# EAGLE design Board (EAGLE 6.5.0)
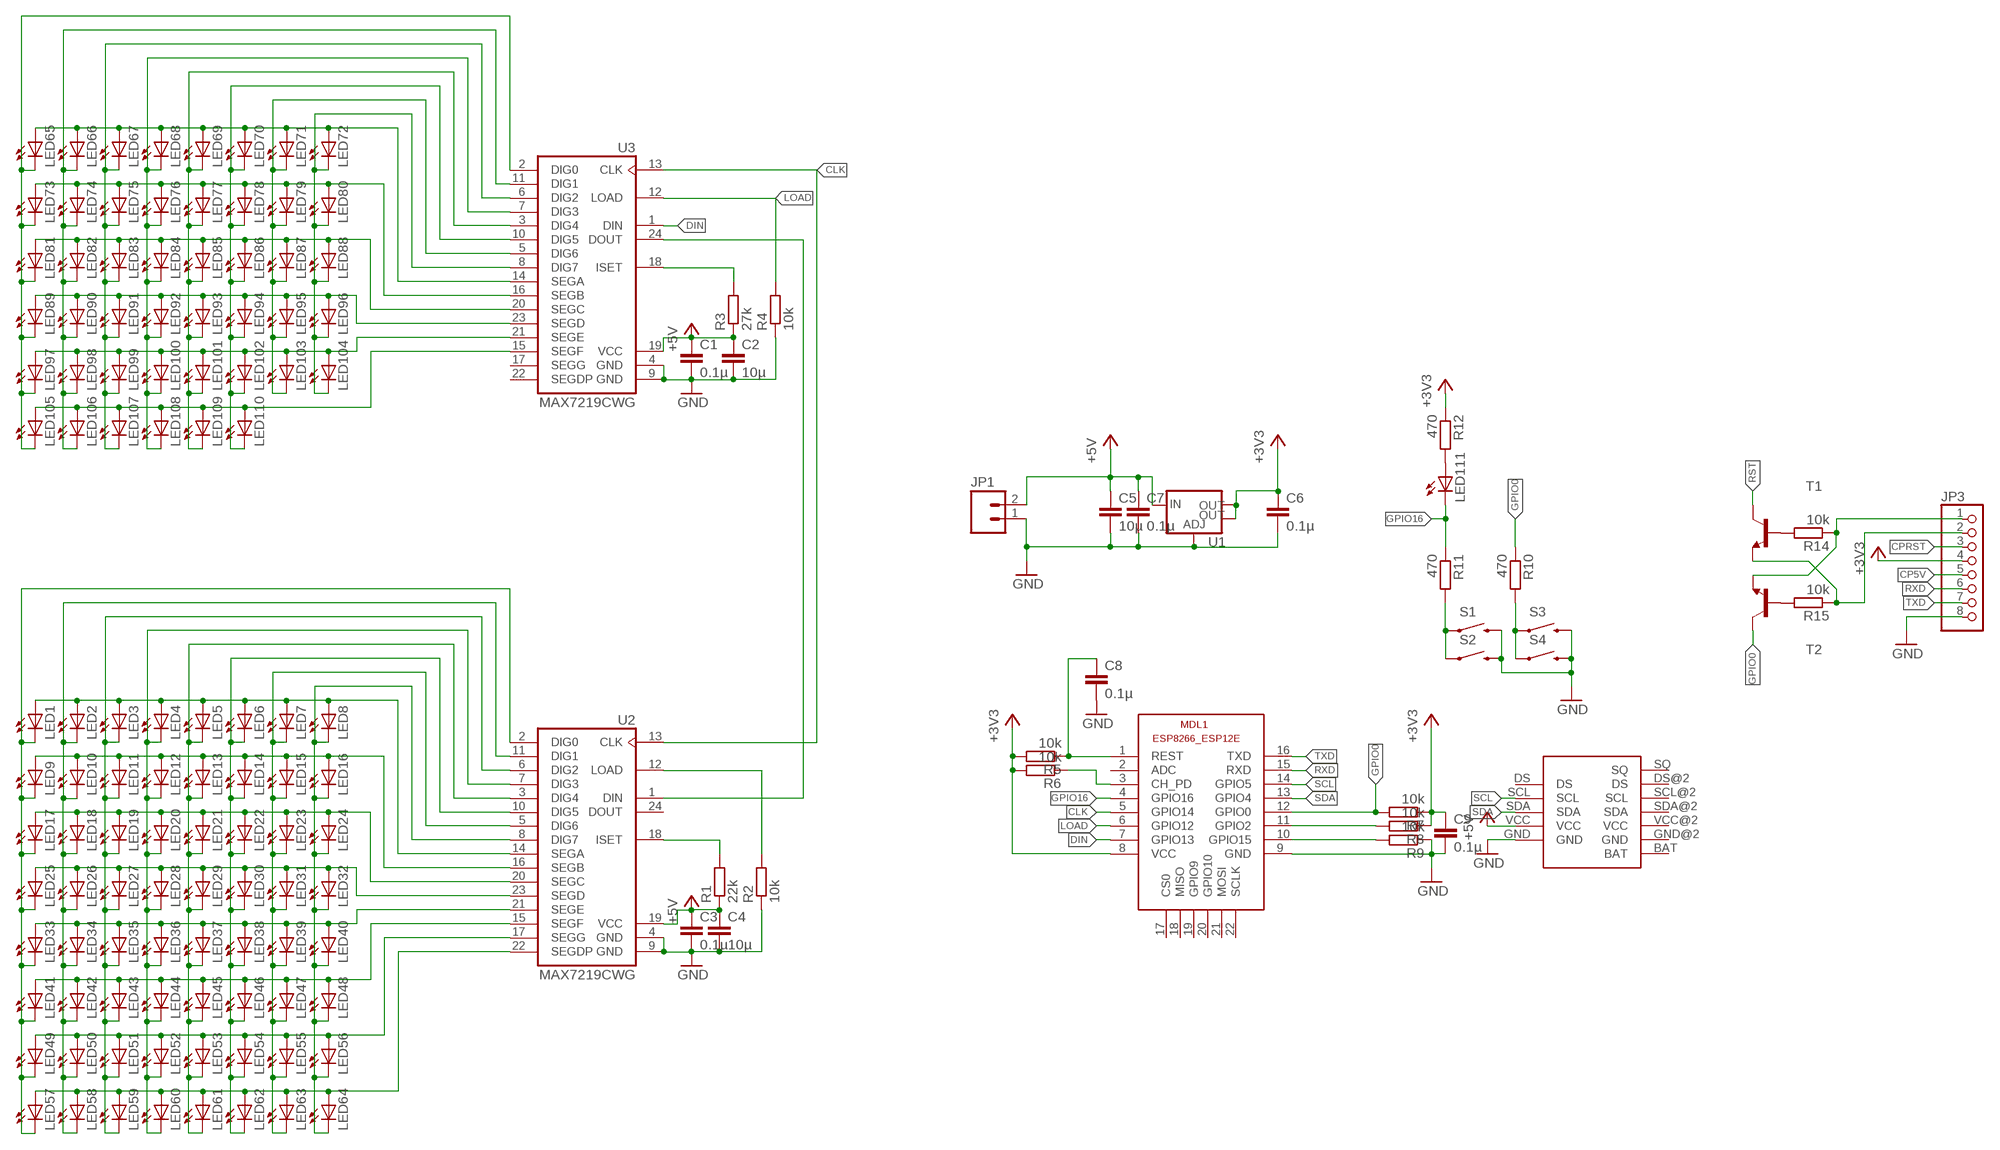
[diagram p0: schematic, sheet 1]

## Parts
C1  0.1µ  C-EUC0603  [C0603]
C2  10µ  C-EUC0603  [C0603]
C3  0.1µ  C-EUC0603  [C0603]
C4  10µ  C-EUC0603  [C0603]
C5  10µ  C-EUC0603  [C0603]
C6  0.1µ  C-EUC0603  [C0603]
C7  0.1µ  C-EUC0603  [C0603]
C8  0.1µ  C-EUC0603  [C0603]
C9  0.1µ  C-EUC0603  [C0603]
JP1  M02POLAR  [MOLEX-1X2]
JP3  PINHD-1X8  [1X08]
LED1  LEDCHIPLED_0805  [CHIPLED_0805]
LED2  LEDCHIPLED_0805  [CHIPLED_0805]
LED3  LEDCHIPLED_0805  [CHIPLED_0805]
LED4  LEDCHIPLED_0805  [CHIPLED_0805]
LED5  LEDCHIPLED_0805  [CHIPLED_0805]
LED6  LEDCHIPLED_0805  [CHIPLED_0805]
LED7  LEDCHIPLED_0805  [CHIPLED_0805]
LED8  LEDCHIPLED_0805  [CHIPLED_0805]
LED9  LEDCHIPLED_0805  [CHIPLED_0805]
LED10  LEDCHIPLED_0805  [CHIPLED_0805]
LED11  LEDCHIPLED_0805  [CHIPLED_0805]
LED12  LEDCHIPLED_0805  [CHIPLED_0805]
LED13  LEDCHIPLED_0805  [CHIPLED_0805]
LED14  LEDCHIPLED_0805  [CHIPLED_0805]
LED15  LEDCHIPLED_0805  [CHIPLED_0805]
LED16  LEDCHIPLED_0805  [CHIPLED_0805]
LED17  LEDCHIPLED_0805  [CHIPLED_0805]
LED18  LEDCHIPLED_0805  [CHIPLED_0805]
LED19  LEDCHIPLED_0805  [CHIPLED_0805]
LED20  LEDCHIPLED_0805  [CHIPLED_0805]
LED21  LEDCHIPLED_0805  [CHIPLED_0805]
LED22  LEDCHIPLED_0805  [CHIPLED_0805]
LED23  LEDCHIPLED_0805  [CHIPLED_0805]
LED24  LEDCHIPLED_0805  [CHIPLED_0805]
LED25  LEDCHIPLED_0805  [CHIPLED_0805]
LED26  LEDCHIPLED_0805  [CHIPLED_0805]
LED27  LEDCHIPLED_0805  [CHIPLED_0805]
LED28  LEDCHIPLED_0805  [CHIPLED_0805]
LED29  LEDCHIPLED_0805  [CHIPLED_0805]
LED30  LEDCHIPLED_0805  [CHIPLED_0805]
LED31  LEDCHIPLED_0805  [CHIPLED_0805]
LED32  LEDCHIPLED_0805  [CHIPLED_0805]
LED33  LEDCHIPLED_0805  [CHIPLED_0805]
LED34  LEDCHIPLED_0805  [CHIPLED_0805]
LED35  LEDCHIPLED_0805  [CHIPLED_0805]
LED36  LEDCHIPLED_0805  [CHIPLED_0805]
LED37  LEDCHIPLED_0805  [CHIPLED_0805]
LED38  LEDCHIPLED_0805  [CHIPLED_0805]
LED39  LEDCHIPLED_0805  [CHIPLED_0805]
LED40  LEDCHIPLED_0805  [CHIPLED_0805]
LED41  LEDCHIPLED_0805  [CHIPLED_0805]
LED42  LEDCHIPLED_0805  [CHIPLED_0805]
LED43  LEDCHIPLED_0805  [CHIPLED_0805]
LED44  LEDCHIPLED_0805  [CHIPLED_0805]
LED45  LEDCHIPLED_0805  [CHIPLED_0805]
LED46  LEDCHIPLED_0805  [CHIPLED_0805]
LED47  LEDCHIPLED_0805  [CHIPLED_0805]
LED48  LEDCHIPLED_0805  [CHIPLED_0805]
LED49  LEDCHIPLED_0805  [CHIPLED_0805]
LED50  LEDCHIPLED_0805  [CHIPLED_0805]
LED51  LEDCHIPLED_0805  [CHIPLED_0805]
LED52  LEDCHIPLED_0805  [CHIPLED_0805]
LED53  LEDCHIPLED_0805  [CHIPLED_0805]
LED54  LEDCHIPLED_0805  [CHIPLED_0805]
LED55  LEDCHIPLED_0805  [CHIPLED_0805]
LED56  LEDCHIPLED_0805  [CHIPLED_0805]
LED57  LEDCHIPLED_0805  [CHIPLED_0805]
LED58  LEDCHIPLED_0805  [CHIPLED_0805]
LED59  LEDCHIPLED_0805  [CHIPLED_0805]
LED60  LEDCHIPLED_0805  [CHIPLED_0805]
LED61  LEDCHIPLED_0805  [CHIPLED_0805]
LED62  LEDCHIPLED_0805  [CHIPLED_0805]
LED63  LEDCHIPLED_0805  [CHIPLED_0805]
LED64  LEDCHIPLED_0805  [CHIPLED_0805]
LED65  LEDCHIPLED_0805  [CHIPLED_0805]
LED66  LEDCHIPLED_0805  [CHIPLED_0805]
LED67  LEDCHIPLED_0805  [CHIPLED_0805]
LED68  LEDCHIPLED_0805  [CHIPLED_0805]
LED69  LEDCHIPLED_0805  [CHIPLED_0805]
LED70  LEDCHIPLED_0805  [CHIPLED_0805]
LED71  LEDCHIPLED_0805  [CHIPLED_0805]
LED72  LEDCHIPLED_0805  [CHIPLED_0805]
LED73  LEDCHIPLED_0805  [CHIPLED_0805]
LED74  LEDCHIPLED_0805  [CHIPLED_0805]
LED75  LEDCHIPLED_0805  [CHIPLED_0805]
LED76  LEDCHIPLED_0805  [CHIPLED_0805]
LED77  LEDCHIPLED_0805  [CHIPLED_0805]
LED78  LEDCHIPLED_0805  [CHIPLED_0805]
LED79  LEDCHIPLED_0805  [CHIPLED_0805]
LED80  LEDCHIPLED_0805  [CHIPLED_0805]
LED81  LEDCHIPLED_0805  [CHIPLED_0805]
LED82  LEDCHIPLED_0805  [CHIPLED_0805]
LED83  LEDCHIPLED_0805  [CHIPLED_0805]
LED84  LEDCHIPLED_0805  [CHIPLED_0805]
LED85  LEDCHIPLED_0805  [CHIPLED_0805]
LED86  LEDCHIPLED_0805  [CHIPLED_0805]
LED87  LEDCHIPLED_0805  [CHIPLED_0805]
LED88  LEDCHIPLED_0805  [CHIPLED_0805]
LED89  LEDCHIPLED_0805  [CHIPLED_0805]
LED90  LEDCHIPLED_0805  [CHIPLED_0805]
LED91  LEDCHIPLED_0805  [CHIPLED_0805]
LED92  LEDCHIPLED_0805  [CHIPLED_0805]
LED93  LEDCHIPLED_0805  [CHIPLED_0805]
LED94  LEDCHIPLED_0805  [CHIPLED_0805]
LED95  LEDCHIPLED_0805  [CHIPLED_0805]
LED96  LEDCHIPLED_0805  [CHIPLED_0805]
LED97  LEDCHIPLED_0805  [CHIPLED_0805]
LED98  LEDCHIPLED_0805  [CHIPLED_0805]
LED99  LEDCHIPLED_0805  [CHIPLED_0805]
LED100  LEDCHIPLED_0805  [CHIPLED_0805]
LED101  LEDCHIPLED_0805  [CHIPLED_0805]
LED102  LEDCHIPLED_0805  [CHIPLED_0805]
LED103  LEDCHIPLED_0805  [CHIPLED_0805]
LED104  LEDCHIPLED_0805  [CHIPLED_0805]
LED105  LEDCHIPLED_0805  [CHIPLED_0805]
LED106  LEDCHIPLED_0805  [CHIPLED_0805]
LED107  LEDCHIPLED_0805  [CHIPLED_0805]
LED108  LEDCHIPLED_0805  [CHIPLED_0805]
LED109  LEDCHIPLED_0805  [CHIPLED_0805]
LED110  LEDCHIPLED_0805  [CHIPLED_0805]
LED111  LEDCHIPLED_0805  [CHIPLED_0805]
MDL1  ESP8266-12EESP8266-ESP12E  [ESP8266-ESP12E]
R1  22k  R-EU_R0603  [R0603]
R2  10k  R-EU_R0603  [R0603]
R3  27k  R-EU_R0603  [R0603]
R4  10k  R-EU_R0603  [R0603]
R5  10k  R-EU_R0603  [R0603]
R6  10k  R-EU_R0603  [R0603]
R7  10k  R-EU_R0603  [R0603]
R8  10k  R-EU_R0603  [R0603]
R9  10k  R-EU_R0603  [R0603]
R10  470  R-EU_R0603  [R0603]
R11  470  R-EU_R0603  [R0603]
R12  470  R-EU_R0603  [R0603]
R14  10k  R-EU_R0603  [R0603]
R15  10k  R-EU_R0603  [R0603]
S1  SWITCH-MOMENTARY-2SIDE_EZ  [TACTILE-PTH-SIDEEZ]
S2  SWITCH-MOMENTARY-2SMD-1101NE  [TACTILE-SWITCH-1101NE]
S3  SWITCH-MOMENTARY-2SIDE_EZ  [TACTILE-PTH-SIDEEZ]
S4  SWITCH-MOMENTARY-2SMD-1101NE  [TACTILE-SWITCH-1101NE]
T1  BC847-NPN-SOT23-BEC  [SOT23-BEC]
T2  BC847-NPN-SOT23-BEC  [SOT23-BEC]
U1  V_REG_LM1117SOT223  [SOT223]
U2  MAX7219CWG  [SO24L]
U3  MAX7219CWG  [SO24L]
U$3  DS1307-MODULE  [DS1307-MODULE]

## Nets
+3V3: C6.1 C9.1 JP3.4 MDL1.8(VCC) R5.2 R6.2 R7.1 R8.1 R12.1 U1.2(OUT) U1.4(OUT)
+5V: C1.1 C2.1 C3.1 C4.1 C5.1 C7.1 JP1.2 R1.1 R3.1 U1.3(IN) U2.19(VCC) U3.19(VCC) U$3.VCC
CLK: MDL1.5(GPIO14) U2.13(CLK) U3.13(CLK)
CP5V: JP3.5
CPRST: JP3.3
DIN: MDL1.7(GPIO13) U3.1(DIN)
DTR: JP3.1 R14.1 T2.E
GND: C1.2 C2.2 C3.2 C4.2 C5.2 C6.2 C7.2 C8.2 C9.2 JP1.1 JP3.8 MDL1.9(GND) R2.1 R4.1 R9.1 S1.2 S2.2 S3.2 S4.2 U1.1(ADJ) U2.4(GND) U2.9(GND) U3.4(GND) U3.9(GND) U$3.GND
GPIO0: MDL1.12(GPIO0) R7.2 R10.1 T2.C
GPIO16: LED111.C MDL1.4(GPIO16) R11.1
LOAD: MDL1.6(GPIO12) R4.2 U3.12(LOAD)
N$1: LED1.C LED9.C LED17.C LED25.C LED33.C LED41.C LED49.C LED57.C U2.2(DIG0)
N$2: LED2.C LED10.C LED18.C LED26.C LED34.C LED42.C LED50.C LED58.C U2.11(DIG1)
N$3: LED9.A LED10.A LED11.A LED12.A LED13.A LED14.A LED15.A LED16.A U2.16(SEGB)
N$4: LED17.A LED18.A LED19.A LED20.A LED21.A LED22.A LED23.A LED24.A U2.20(SEGC)
N$5: LED3.C LED11.C LED19.C LED27.C LED35.C LED43.C LED51.C LED59.C U2.6(DIG2)
N$6: LED4.C LED12.C LED20.C LED28.C LED36.C LED44.C LED52.C LED60.C U2.7(DIG3)
N$7: LED5.C LED13.C LED21.C LED29.C LED37.C LED45.C LED53.C LED61.C U2.3(DIG4)
N$8: LED6.C LED14.C LED22.C LED30.C LED38.C LED46.C LED54.C LED62.C U2.10(DIG5)
N$9: LED7.C LED15.C LED23.C LED31.C LED39.C LED47.C LED55.C LED63.C U2.5(DIG6)
N$10: LED8.C LED16.C LED24.C LED32.C LED40.C LED48.C LED56.C LED64.C U2.8(DIG7)
N$11: LED1.A LED2.A LED3.A LED4.A LED5.A LED6.A LED7.A LED8.A U2.14(SEGA)
N$12: LED25.A LED26.A LED27.A LED28.A LED29.A LED30.A LED31.A LED32.A U2.23(SEGD)
N$13: LED33.A LED34.A LED35.A LED36.A LED37.A LED38.A LED39.A LED40.A U2.21(SEGE)
N$14: LED41.A LED42.A LED43.A LED44.A LED45.A LED46.A LED47.A LED48.A U2.15(SEGF)
N$15: LED49.A LED50.A LED51.A LED52.A LED53.A LED54.A LED55.A LED56.A U2.17(SEGG)
N$16: LED57.A LED58.A LED59.A LED60.A LED61.A LED62.A LED63.A LED64.A U2.22(SEGDP)
N$17: LED66.C LED74.C LED82.C LED90.C LED98.C LED106.C U3.11(DIG1)
N$18: LED65.C LED73.C LED81.C LED89.C LED97.C LED105.C U3.2(DIG0)
N$19: LED67.C LED75.C LED83.C LED91.C LED99.C LED107.C U3.6(DIG2)
N$20: LED68.C LED76.C LED84.C LED92.C LED100.C LED108.C U3.7(DIG3)
N$21: LED69.C LED77.C LED85.C LED93.C LED101.C LED109.C U3.3(DIG4)
N$22: LED70.C LED78.C LED86.C LED94.C LED102.C LED110.C U3.10(DIG5)
N$23: LED71.C LED79.C LED87.C LED95.C LED103.C U3.5(DIG6)
N$24: LED72.C LED80.C LED88.C LED96.C LED104.C U3.8(DIG7)
N$25: LED65.A LED66.A LED67.A LED68.A LED69.A LED70.A LED71.A LED72.A U3.14(SEGA)
N$26: LED73.A LED74.A LED75.A LED76.A LED77.A LED78.A LED79.A LED80.A U3.16(SEGB)
N$27: LED81.A LED82.A LED83.A LED84.A LED85.A LED86.A LED87.A LED88.A U3.20(SEGC)
N$28: LED89.A LED90.A LED91.A LED92.A LED93.A LED94.A LED95.A LED96.A U3.23(SEGD)
N$29: LED97.A LED98.A LED99.A LED100.A LED101.A LED102.A LED103.A LED104.A U3.21(SEGE)
N$30: LED105.A LED106.A LED107.A LED108.A LED109.A LED110.A U3.15(SEGF)
N$32: R10.2 S3.1 S4.1
N$33: R2.2 U2.12(LOAD)
N$34: R14.2 T1.B
N$35: U2.1(DIN) U3.24(DOUT)
N$36: MDL1.3(CH_PD) R6.1
N$38: R15.2 T2.B
N$39: LED111.A R12.2
N$40: MDL1.11(GPIO2) R8.2
N$41: R3.2 U3.18(ISET)
N$42: MDL1.10(GPIO15) R9.2
N$43: R1.2 U2.18(ISET)
N$45: R11.2 S1.1 S2.1
RST: C8.1 MDL1.1(REST) R5.1 T1.C
RTS: JP3.2 R15.1 T1.E
RXD: JP3.6 MDL1.15(RXD)
SCL: MDL1.14(GPIO5) U$3.SCL
SDA: MDL1.13(GPIO4) U$3.SDA
TXD: JP3.7 MDL1.16(TXD)
Unconnected: MDL1.2(ADC) MDL1.17(CS0) MDL1.18(MISO) MDL1.19(GPIO9) MDL1.20(GPIO10) MDL1.21(MOSI) MDL1.22(SCLK) U2.24(DOUT) U3.17(SEGG) U3.22(SEGDP) U$3.BAT U$3.DS U$3.DS@2(DS) U$3.GND@2(GND) U$3.SCL@2(SCL) U$3.SDA@2(SDA) U$3.SQ U$3.VCC@2(VCC)

## Library data of the parts
C1-C9 = rcl:C-EU: CAPACITOR, European symbol
JP1 = SparkFun-Connectors:M02: Standard 2-pin 0.1" header. Use with - straight break away headers ( PRT-00116) - right angle break away headers (PRT-00553) - swiss pins (PRT-00743) - machine pins (PRT-00117) - female headers (PRT-00115) Molex polarized connector foot print use with: PRT-08233 with associated crimp pins and housings. 2.54_SCREWTERM for use with PRT-10571. 3.5mm Screw Terminal footprints for PRT-08084 5mm Screw Terminal footprints for use with PRT-08432
JP3 = pinhead:PINHD-1X8: PIN HEADER
LED1-LED111 = led:LED: LED OSRAM: - CHIPLED LG R971, LG N971, LY N971, LG Q971, LY Q971, LO R971, LY R971 LH N974, LH R974 LS Q976, LO Q976, LY Q976 LO Q996 - Hyper CHIPLED LW Q18S LB Q993, LB Q99A, LB R99A - SideLED LS A670, LO A670, LY A670, LG A670, LP A670 LB A673, LV A673, LT A673, LW A673 LH A674 LY A675 LS A676, LA A676, LO A676, LY A676, LW A676 LS A679, LY A679, LG A679 - Hyper Micro SIDELED® LS Y876, LA Y876, LO Y876, LY Y876 LT Y87S - SmartLED LW L88C, LW L88S LB L89C, LB L89S, LG L890 LS L89K, LO L89K, LY L89K LS L896, LA L896, LO L896, LY L896 - TOPLED LS T670, LO T670, LY T670, LG T670, LP T670 LSG T670, LSP T670, LSY T670, LOP T670, LYG T670 LG T671, LOG T671, LSG T671 LB T673, LV T673, LT T673, LW T673 LH T674 LS T676, LA T676, LO T676, LY T676, LB T676, LH T676, LSB T676, LW T676 LB T67C, LV T67C, LT T67C, LS T67K, LO T67K, LY T67K, LW E67C LS E67B, LA E67B, LO E67B, LY E67B, LB E67C, LV E67C, LT E67C LW T67C LS T679, LY T679, LG T679 LS T770, LO T770, LY T770, LG T770, LP T770 LB T773, LV T773, LT T773, LW T773 LH T774 LS E675, LA E675, LY E675, LS T675 LS T776, LA T776, LO T776, LY T776, LB T776 LHGB T686 LT T68C, LB T68C - Hyper Mini TOPLED® LB M676 - Mini TOPLED Santana® LG M470 LS M47K, LO M47K, LY M47K Source: http://www.osram.convergy.de LUXEON: - LUMILED® LXK2-PW12-R00, LXK2-PW12-S00, LXK2-PW14-U00, LXK2-PW14-V00 LXK2-PM12-R00, LXK2-PM12-S00, LXK2-PM14-U00 LXK2-PE12-Q00, LXK2-PE12-R00, LXK2-PE12-S00, LXK2-PE14-T00, LXK2-PE14-U00 LXK2-PB12-K00, LXK2-PB12-L00, LXK2-PB12-M00, LXK2-PB14-N00, LXK2-PB14-P00, LXK2-PB14-Q00 LXK2-PR12-L00, LXK2-PR12-M00, LXK2-PR14-Q00, LXK2-PR14-R00 LXK2-PD12-Q00, LXK2-PD12-R00, LXK2-PD12-S00 LXK2-PH12-R00, LXK2-PH12-S00 LXK2-PL12-P00, LXK2-PL12-Q00, LXK2-PL12-R00 Source: www.luxeon.com KINGBRIGHT: KA-3528ASYC Source: www.kingbright.com
MDL1 = ESP8266-ESP12E:ESP8266-12E: ESP8266-12E with additional I/O and GPIO04/05 corrected The author cannot warrant that this library is free from error or will meet your specific requirements. Created by PuceBaboon.com. Komagane, Nagano, JAPAN
R1-R12 R14 R15 = rcl:R-EU_: RESISTOR, European symbol
S1 S3 = SparkFun-Electromechanical:SWITCH-MOMENTARY-2: Various NO switches- pushbuttons, reed, etc
S2 S4 = SparkFun-Electromechanical:SWITCH-MOMENTARY-2: Various NO switches- pushbuttons, reed, etc; PROD_ID: SWCH-00815
T1 T2 = transistor:*-NPN-: NPN Transistror BF959 corrected 2008.03.06
U1 = SparkFun-PowerIC:V_REG_LM1117: Voltage Regulator LM1117 Standard adjustable voltage regulator but in SMD form. Spark Fun Electronics SKU : COM-00595; PROD_ID: VREG-08170
U2 U3 = max7219:MAX7219CWG
U$3 = OwnStuff:DS1307-MODULE

## Board
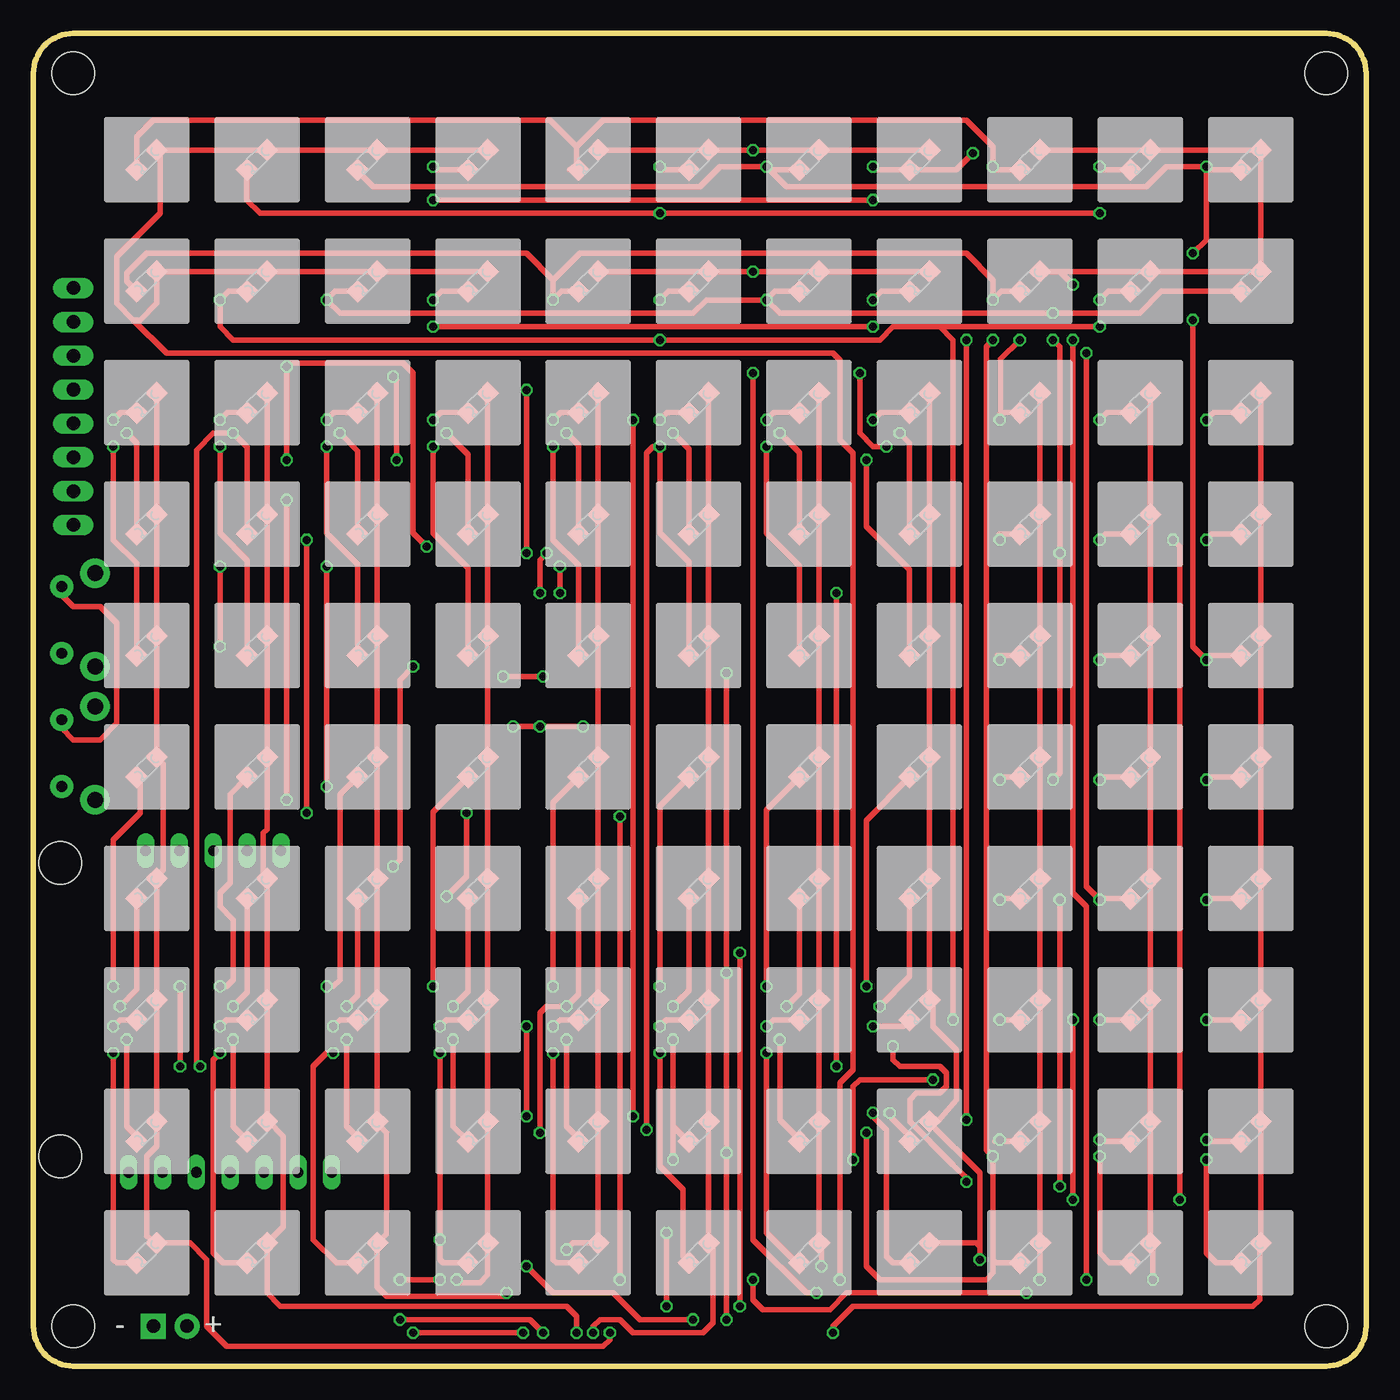
[diagram p1: board, top side]
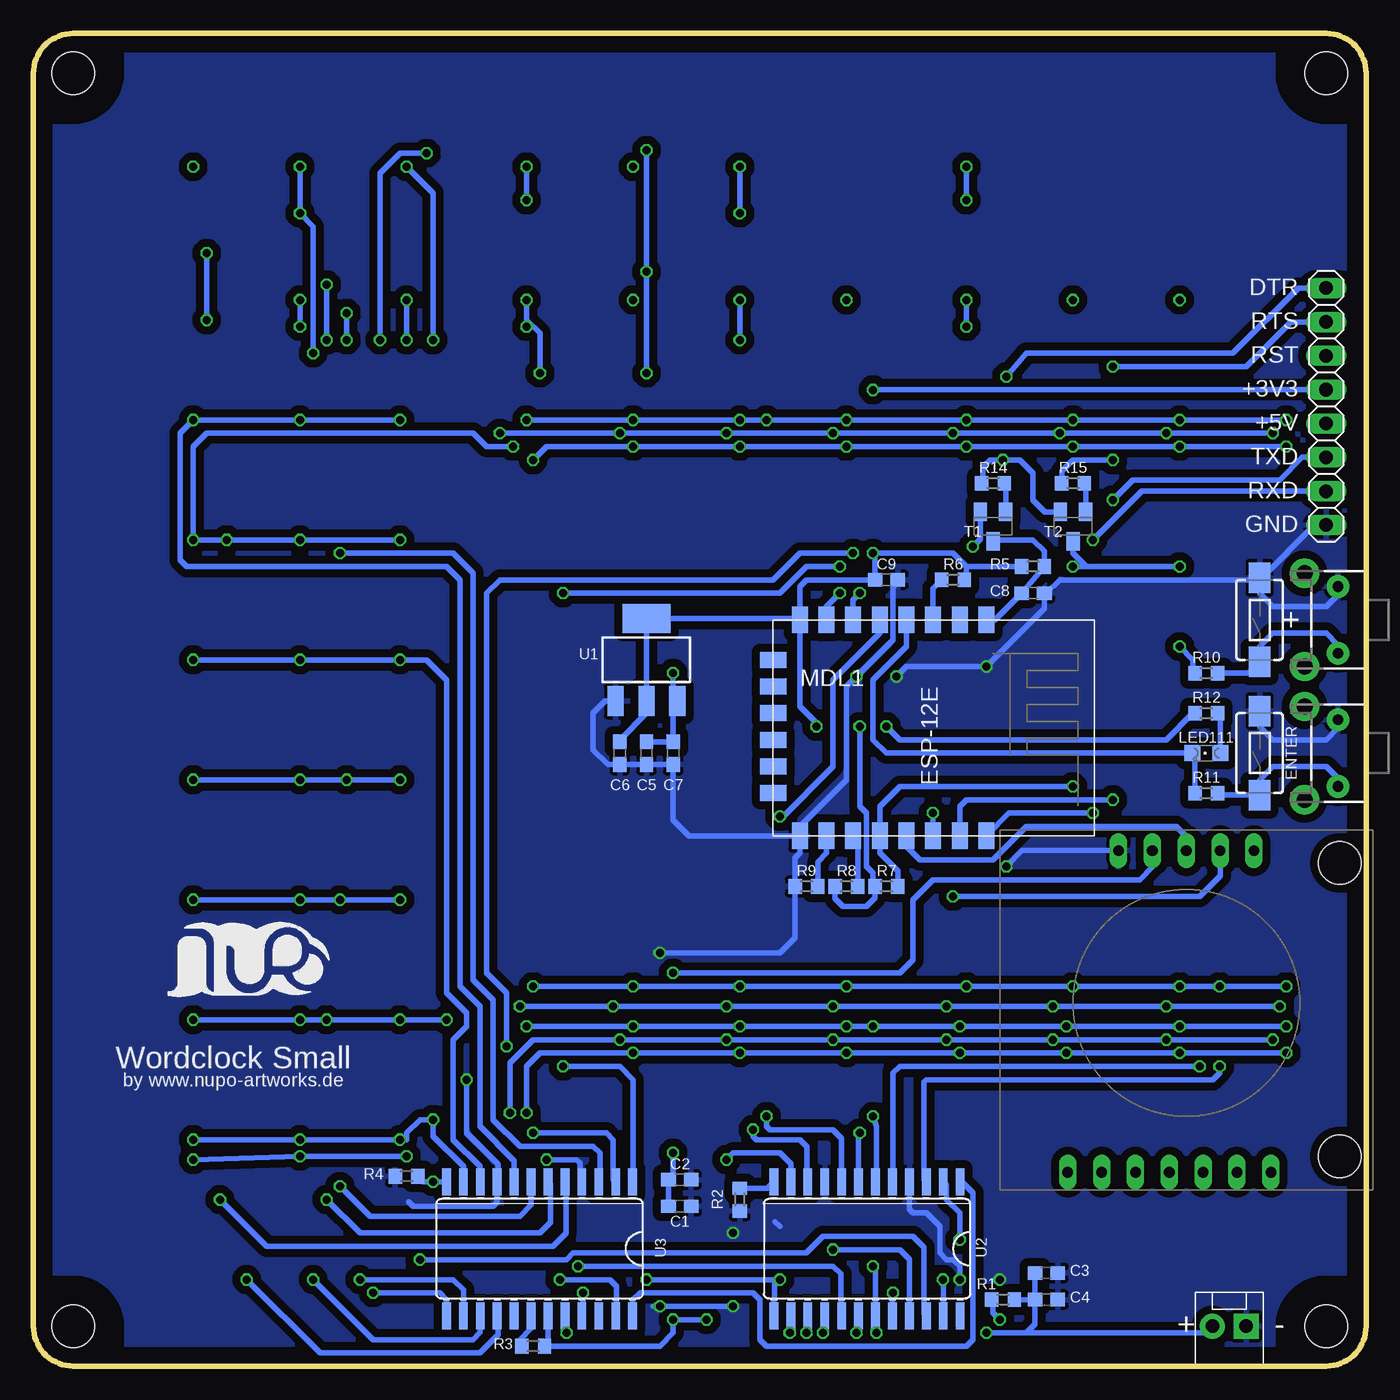
[diagram p2: board, bottom side, seen from below]

Size 100 x 100 mm. Coordinates in mm from the lower left corner, seen from the top.
Outline: 3,0 arc-90 0,3 0,97 arc-90 3,100 97,100 arc-90 100,97 100,3 arc-90 97,0 3,0
Copper layers (1*16): Top 0.035mm / dielectric 1.5mm / Bottom 0.035mm
Design rules "dirt_cheap_dirty_boards.v1": minimum track width 5mil, minimum drill 12mil, track to track 5mil, track to pad 5mil, pad to pad 5mil, via to via 5mil, smd to smd 0mil, copper to edge 10mil, drill to drill 10mil, minimum pad ring 10mil, minimum via ring 6mil, stop-mask expansion 2mil, vias tented up to drill 25mil, thermal gap 10mil
Holes 3.2 mm at 3,97 97,97 3,3 97,3
tKeepout: area 21,40 to 27,56; 4 lines
bKeepout: area 21,40 to 27,56; 4 lines
tRestrict: area 0,0 to 6,6; area 94,94 to 100,100; area 94,0 to 100,6; area 0,94 to 6,100; 4 lines
bRestrict: area 0,0 to 6,6; area 0,94 to 6,100; area 94,94 to 100,100; area 94,0 to 100,6; 4 lines

### Footprints (pad centres in the part's own frame; a part is rotated, then mirrored left to right if it is on the bottom)
C0603 = smd 1.1 x 1: 1 -0.85,0; 2 0.85,0
MOLEX-1X2 = drill 1.016 pad 1.88 square: 1 0,0 | drill 1.016 pad 1.88: 2 2.54,0
1X08 = drill 1.016 long: 1 -8.89,0; 2 -6.35,0; 3 -3.81,0; 4 -1.27,0; 5 1.27,0; 6 3.81,0; 7 6.35,0; 8 8.89,0
CHIPLED_0805 = smd 1.2 x 1.2: A 0,-1.05; C 0,1.05
ESP8266-ESP12E = smd 2 x 1.2: 1 0,16; 2 0,14; 3 0,12; 4 0,10; 5 0,8; 6 0,6; 7 0,4; 8 0,2; 9 16.2,2; 10 16.2,4; 11 16.2,6; 12 16.2,8; 13 16.2,10; 14 16.2,12; 15 16.2,14; 16 16.2,16 | smd 1.2 x 2: 17 11,0; 18 3,0; 19 5,0; 20 13,0; 21 7,0; 22 9,0
R0603 = smd 1 x 1.1: 1 -0.85,0; 2 0.85,0
TACTILE-PTH-SIDEEZ = drill 0.8 pad 1.7: 1 -2.5,0; 2 2.5,0 | drill 1.2 pad 2.2: ANCHOR1 -3.5,2.5; ANCHOR2 3.5,2.5
TACTILE-SWITCH-1101NE = smd 2.3 x 1.6: 1 -3.15,0; 2 3.15,0
SOT23-BEC = smd 1 x 1.4: B -0.95,-1.1; C 0,1.1; E 0.95,-1.1
SOT223 = smd 1.219 x 2.235: 1 -2.311,-3.099; 2 0,-3.099; 3 2.311,-3.099 | smd 3.6 x 2.2: 4 0,3.099
SO24L = smd 0.66 x 2.032: 1 -6.985,-5.029; 2 -5.715,-5.029; 3 -4.445,-5.029; 4 -3.175,-5.029; 5 -1.905,-5.029; 6 -0.635,-5.029; 7 0.635,-5.029; 8 1.905,-5.029; 9 3.175,-5.029; 10 4.445,-5.029; 11 5.715,-5.029; 12 6.985,-5.029; 13 6.985,5.029; 14 5.715,5.029; 15 4.445,5.029; 16 3.175,5.029; 17 1.905,5.029; 18 0.635,5.029; 19 -0.635,5.029; 20 -1.905,5.029; 21 -3.175,5.029; 22 -4.445,5.029; 23 -5.715,5.029; 24 -6.985,5.029
DS1307-MODULE = drill 0.8 long: BAT -8.89,-12.7; DS 5.08,11.43; DS@2 3.81,-12.7; GND -5.08,11.43; GND@2 -6.35,-12.7; SCL 2.54,11.43; SCL@2 1.27,-12.7; SDA 0,11.43; SDA@2 -1.27,-12.7; SQ 6.35,-12.7; VCC -2.54,11.43; VCC@2 -3.81,-12.7 | hole 3.2: 11.5,-11.5; 11.5,10.5

### Placement (x,y rotation side)
C1  51.5,14 0 bottom
C2  51.5,12 0 bottom
C3  24,7 0 bottom
C4  24,5 0 bottom
C5  54,46 270 bottom
C6  56,46 270 bottom
C7  52,46 270 bottom
C8  25,58 0 bottom
C9  36,59 0 bottom
JP1  9,3 180 bottom
JP3  3,72 270 bottom
LED1  8.5,8.5 135 top
LED2  8.5,17.61 135 top
LED3  8.5,26.72 135 top
LED4  8.5,35.83 135 top
LED5  8.5,44.95 135 top
LED6  8.5,54.06 135 top
LED7  8.5,63.17 135 top
LED8  8.5,72.28 135 top
LED9  16.78,8.5 135 top
LED10  16.78,17.61 135 top
LED11  16.78,26.72 135 top
LED12  16.78,35.83 135 top
LED13  16.78,44.95 135 top
LED14  16.78,54.06 135 top
LED15  16.78,63.17 135 top
LED16  16.78,72.28 135 top
LED17  25.07,8.5 135 top
LED18  25.07,17.61 135 top
LED19  25.07,26.72 135 top
LED20  25.07,35.83 135 top
LED21  25.07,44.95 135 top
LED22  25.07,54.06 135 top
LED23  25.07,63.17 135 top
LED24  25.07,72.28 135 top
LED25  33.35,8.5 135 top
LED26  33.35,17.61 135 top
LED27  33.35,26.72 135 top
LED28  33.35,35.83 135 top
LED29  33.35,44.95 135 top
LED30  33.35,54.06 135 top
LED31  33.35,63.17 135 top
LED32  33.35,72.28 135 top
LED33  41.64,8.5 135 top
LED34  41.64,17.61 135 top
LED35  41.64,26.72 135 top
LED36  41.64,35.83 135 top
LED37  41.64,44.95 135 top
LED38  41.64,54.06 135 top
LED39  41.64,63.17 135 top
LED40  41.64,72.28 135 top
LED41  49.92,8.5 135 top
LED42  49.92,17.61 135 top
LED43  49.92,26.72 135 top
LED44  49.92,35.83 135 top
LED45  49.92,44.95 135 top
LED46  49.92,54.06 135 top
LED47  49.92,63.17 135 top
LED48  49.92,72.28 135 top
LED49  58.21,8.5 135 top
LED50  58.21,17.61 135 top
LED51  58.21,26.72 135 top
LED52  58.21,35.83 135 top
LED53  58.21,44.95 135 top
LED54  58.21,54.06 135 top
LED55  58.21,63.17 135 top
LED56  58.21,72.28 135 top
LED57  66.49,8.5 135 top
LED58  66.49,17.61 135 top
LED59  66.49,26.72 135 top
LED60  66.49,35.83 135 top
LED61  66.49,44.95 135 top
LED62  66.49,54.06 135 top
LED63  66.49,63.17 135 top
LED64  66.49,72.28 135 top
LED65  74.77,8.5 135 top
LED66  74.77,17.61 135 top
LED67  74.77,26.72 135 top
LED68  74.77,35.83 135 top
LED69  74.77,44.95 135 top
LED70  74.77,54.06 135 top
LED71  74.77,63.17 135 top
LED72  74.77,72.28 135 top
LED73  83.06,8.5 135 top
LED74  83.06,17.61 135 top
LED75  83.06,26.72 135 top
LED76  83.06,35.83 135 top
LED77  83.06,44.95 135 top
LED78  83.06,54.06 135 top
LED79  83.06,63.17 135 top
LED80  83.06,72.28 135 top
LED81  91.34,8.5 135 top
LED82  91.34,17.61 135 top
LED83  91.34,26.72 135 top
LED84  91.34,35.83 135 top
LED85  91.34,44.95 135 top
LED86  91.34,54.06 135 top
LED87  91.34,63.17 135 top
LED88  91.34,72.28 135 top
LED89  8.5,81.39 135 top
LED90  8.5,90.5 135 top
LED91  16.78,81.39 135 top
LED92  16.78,90.5 135 top
LED93  25.07,81.39 135 top
LED94  25.07,90.5 135 top
LED95  33.35,81.39 135 top
LED96  33.35,90.5 135 top
LED97  41.64,81.39 135 top
LED98  41.64,90.5 135 top
LED99  49.92,81.39 135 top
LED100  49.92,90.5 135 top
LED101  58.21,81.39 135 top
LED102  58.21,90.5 135 top
LED103  66.49,81.39 135 top
LED104  66.49,90.5 135 top
LED105  74.77,81.39 135 top
LED106  74.77,90.5 135 top
LED107  83.06,81.39 135 top
LED108  83.06,90.5 135 top
LED109  91.34,81.39 135 top
LED110  91.34,90.5 135 top
LED111  12,46 90 bottom
MDL1  44.5,56 270 bottom
R1  27.25,5 180 bottom
R2  47,12.5 90 bottom
R3  62.5,1.5 180 bottom
R4  72,14.25 0 bottom
R5  25,60 180 bottom
R6  31,59 0 bottom
R7  36,36 0 bottom
R8  39,36 0 bottom
R9  42,36 0 bottom
R10  12,52 0 bottom
R11  12,43 0 bottom
R12  12,49 0 bottom
R14  28,66.25 0 bottom
R15  22,66.25 0 bottom
S1  2.12,46 90 bottom
S2  8,46 90 bottom
S3  2.12,56 90 bottom
S4  8,56 90 bottom
T1  28,63 180 bottom
T2  22,63 180 bottom
U1  54,53 0 bottom
U2  37.45,8.81 180 bottom
U3  62.02,8.81 180 bottom
U$1  [LOGO-SILKSCREEN]  84,29.5 0 bottom
U$3  13.5,27.25 0 bottom

### Tracks (layer width: path | path; a pad name or v marks a point on that pad's centre or on a via)
+3V3  (via drill 0.6)
  Top 0.406: v41.25,48 v38,48 v36,48 | v37,73.25 v37,61
  Bottom 0.406: R8.1 39.85,35.1 39.25,34.5 37.5,34.5 36.85,35.15 R7.1 37,36.15 37,37 37.5,37.5 37.5,41.5 38,42 v38,48 | C6.1 56,47 54,49 U1.2 U1.4 42.6,56.1 MDL1.8 | MDL1.8 42.5,58.5 42,59 C9.1 36.85,60.65 v37,61 31,61 30,60 | 30,60 30,59.15 R6.2 | R5.2 30,60 | R12.1 13,49 15,47 35,47 v36,48 | MDL1.8 42.5,49.5 41,48 v41.25,48 | JP3.4 36.98,73.27 v37,73.25
+5V  (via drill 0.6)
  Top 0.406: v52,3.5 v52,16 v52,29.5 v52,52 | v49.5,3.5 45.5,3.5 43.5,5.5 39,5.5 v37,7.5 | v28.5,2.5 v36.75,2.5
  Bottom 0.406: v49.5,3.5 v52,3.5 52,2.5 53,1.5 R3.1 61.38,1.76 U3.19 | 37.12,7.38 v37,7.5 36.81,7.32 U2.19 | C5.1 C7.1 52,49.59 U1.3 52,50.21 v52,52 | v52,29.5 35,29.5 34,30.5 34,35 32.5,36.5 17,36.5 16,37.5 16,38.47 U$3.VCC | U2.19 36.81,4.82 | C3.1 C4.1 | C4.1 24.85,3.15 25.5,2.5 | 25.5,2.5 v28.5,2.5 | v36.75,2.5 36.75,3.72 U2.19 | 25.5,2.5 12.04,2.5 JP1.2 | R1.1 C4.1 | C1.1 C2.1 52.35,13.65 52,14 v52,16
CLK  (via drill 0.6)
  Top 0.406: v54,6.5 54,5 54.75,4.25 59.75,4.25 61,5.5 v74.5,5.5 | v44,6.5 v44,41.25
  Bottom 0.406: U2.13 44.39,6.14 v44,6.5 v54,6.5 | MDL1.5 36.5,55 40,51.5 40,45 44,41 v44,41.25 | U3.13 69,5 69.5,5.5 v74.5,5.5
DIN  (via drill 0.6)
  Top 0.406: v60.25,22.5 v60.25,58 | v39.5,58 v39.5,60
  Bottom 0.406: v60.25,58 44,58 42,60 v39.5,60 | MDL1.7 40.5,57 v39.5,58 | v60.25,22.5 56,22.5 55,21.5 55,13.87 U3.1
DTR  (via drill 0.6)
  Top 0.406: v27.25,68 27.25,74.25 v27,74.25
  Bottom 0.406: T2.E 24.1,64.1 25,65 25,67 26,68 v27.25,68 28.25,68 28.75,67.5 28.75,66.1 R14.1 | JP3.1 5.11,80.89 10,76 25.5,76 v27,74.25
GND  (via drill 0.6)
  Top 0.406: v47.5,4.5 v47.5,10 | v61.5,15.5 61.5,21 62,21.5 v67.5,21.5 | S1.2 2.12,47.88 3,47 5,47 6.25,48.25 6.25,55.75 5,57 3,57 2.12,57.88 S3.2 | v53,31 v53,4.5 | v35.25,51.75 v38.25,51.75 | v30.5,6.5 v27.5,6.5 | v28.5,52.5 27.5,51.5 27.5,38 v27,37.5
  Bottom 0.406: 53.5,4.5 v53,4.5 v47.5,4.5 | 44,10.5 44.35,10.85 | v67.5,21.5 67.5,17.5 65.14,15.14 65.14,13.89 U3.9 65.19,12.3 65.5,12 71.5,12 71.85,12.35 | JP3.8 3.11,63 4,63 7.85,59.15 S4.2 8,59 | S2.2 8,48 7,47 3,47 2.12,47.88 S1.2 | S3.2 2.12,57.88 3,57 7,57 8,58 8,59 | 8,59 23,59 24,58 C8.2 24.15,56.85 v28.5,52.5 34.5,52.5 v35.25,51.75 | MDL1.9 42.5,38.5 42.85,38.15 R9.1 42.85,32.15 44,31 v53,31 | U1.1 57.1,49.9 58,49 58,46.25 56.9,45.15 C6.2 C5.2 C7.2 52,41 50.8,39.8 MDL1.9 | MDL1.9 42.5,40.5 39,44 39,51 v38.25,51.75 35.5,54.5 35.5,58.35 C9.2 | JP1.1 9,3.5 | U$3.GND 25.82,38.68 v27,37.5 | U2.4 34.27,11.78 34,11.5 33,11.5 32,10.5 32,8.5 31.5,8 31,8 30.5,7.5 v30.5,6.5 | v61.5,15.5 59.25,15.5 59,15.25 59,14 58.75,13.75 58.76,13.75 U3.4
  pour Bottom (isolate 0.61): 3,0 arc-90 0,3 0,97 arc-90 3,100 97,100 arc-90 100,97 100,3 arc-90 97,0
GPIO0  (via drill 0.6)
  Top 0.406: v14,60 v14,54 | v22,60 v22,43.5
  Bottom 0.406: 21,60 22,61 T2.C 22,62 | 21,60 v14,60 | v14,54 13,53 13,52.15 R10.1 | R7.2 35.15,37.15 36.5,38.5 MDL1.12 36.5,42 35,43.5 v22,43.5 | 21,60 v22,60
GPIO16
  Bottom 0.406: R11.1 12.85,45.8 LED111.C 36,46 37,47 37,51.5 34.5,54 MDL1.4
LOAD  (via drill 0.6)
  Top 0.406: v38,58 38,60.5 v38.5,61 | v64.5,24 64.5,23 65,22.5 68,22.5 68.5,22 68.5,21 68,20.5 66.25,20.5 65.75,20 65.75,18.38 68.81,15.31 69,15.12 70,14.12 v70,13.84
  Bottom 0.406: MDL1.6 38.5,57.5 v38,58 | v38.5,61 42.5,61 44.5,59 65,59 66,58 66,29.5 64.5,28 v64.5,24 | R4.2 70.74,13.84 v70,13.84 U3.12
N$1  (via drill 0.6)
  Top 0.406: LED25.C 30.74,7.76 30.5,8 v30.5,9.5 v30.5,23.5 | LED41.C 48.74,8.26 48.74,13.26 47,15 v47,23.5 | LED57.C 64.5,7.76 64,8.26 64,17.75 63,18.75 v63,19 | LED1.C 6.24,7.76 6,8 v6,23.5 | LED9.C 14.24,7.76 13.5,8.5 13.5,23 v14,23.5 | LED17.C 22.74,7.76 21,9.5 21,22.5 22,23.5 v22.5,23.5 | LED49.C 57.24,7.76 55,10 v55,23.5 | LED33.C 39.24,7.76 39,8 v39,23.5
  Bottom 0.406: v6,23.5 v14,23.5 v22.5,23.5 v30.5,23.5 v39,23.5 v47,23.5 v55,23.5 62,23.5 63,22.5 v63,19 | v30.5,9.5 30.5,11.5 31.5,12.5 31.5,13.6 U2.2
N$2  (via drill 0.6)
  Top 0.406: v48,15.5 48,18 | 48,18 v48,24.5 | LED2.C 8.13,16.87 7,18 v7,24.5 | LED10.C 16.13,16.87 15,18 v15,24.5 | LED18.C 24.63,16.87 23.5,18 v23.5,24.5 | LED26.C 32.61,16.89 31.5,18 v31.5,24.5 | LED34.C 40.9,17.11 40,18 v40,24.5 | LED42.C 49.13,16.87 48,18 | LED50.C 57.46,17.04 56,18.5 v56,24.5 | LED58.C 65.63,16.87 | 66,17.12 LED58.C | v64.25,19 64.25,18.75 65.5,17.5 65.5,17.12 LED58.C
  Bottom 0.406: v7,24.5 v15,24.5 v23.5,24.5 v31.5,24.5 v40,24.5 v48,24.5 v56,24.5 62.5,24.5 64.25,22.75 v64.25,19 | U2.11 43.16,15.16 44,16 47.5,16 v48,15.5
N$3  (via drill 0.6)
  Top 0.406: LED16.A LED15.A LED14.A LED13.A 17.53,40.28 17.25,40 17.25,36.85 LED12.A LED11.A LED10.A 17.65,18.35 18.75,17.25 18.75,10.47 LED9.A 17.53,5.5 18.53,4.5 40,4.5 40.75,3.75 v40.75,2.5
  Bottom 0.406: U2.16 40.62,2.62 v40.75,2.5
N$4  (via drill 0.6)
  Top 0.406: LED24.A LED23.A LED22.A LED21.A LED20.A LED19.A LED18.A 25.81,18.19 26.5,17.5 26.5,9.93 LED17.A 25.81,5.94 26.5,5.25 35.25,5.25 v35.5,5.5
  Bottom 0.406: U2.20 35.55,5.46 v35.5,5.5
N$5  (via drill 0.6)
  Top 0.406: LED3.C 6.52,25.98 v6,25.5 | LED11.C 14.52,25.98 v14,25.5 | LED19.C 23.02,25.98 v22.5,25.5 | LED27.C 31.02,25.98 v30.5,25.5 | LED35.C 39.52,25.98 v39,25.5 | LED43.C 47.52,25.98 v47,25.5 | LED51.C 55.52,25.98 v55,25.5 | v37,18.75 v37,25.5 | v63,25.5 65.27,25.5 LED59.C
  Bottom 0.406: v6,25.5 v14,25.5 v22.5,25.5 v30.5,25.5 v37,25.5 v39,25.5 v47,25.5 v55,25.5 v63,25.5 | v37,18.75 36.75,18 36.75,13.12 36.81,13.19 U2.6
N$6  (via drill 0.6)
  Top 0.406: v38,17.5 38,26.5 38.5,27 v40,27 40.9,27.89 LED36.C | LED4.C 7.76,28.26 v6.5,27 | LED12.C 16.04,28.04 v15,27 | LED20.C 24.33,27.83 v23.5,27 | LED28.C 32.61,28.11 v31.5,27 | LED44.C 49.18,28.18 v48,27 | LED52.C 57.46,27.96 v56.5,27 | LED60.C 65.75,29.25 v63.5,27
  Bottom 0.406: v6.5,27 v15,27 v23.5,27 v31.5,27 v40,27 v48,27 v56.5,27 v63.5,27 | U2.7 38.09,17.41 v38,17.5
N$7  (via drill 0.6)
  Top 0.406: v11,22.5 v11,28.5 | LED13.C 14.75,42.91 14.75,36.25 14,35.5 14,34.5 15,33.5 15,29 14.5,28.5 v14,28.5 | LED21.C 23,42.88 23,29 22.5,28.5 v22,28.5 | LED29.C 30,41.59 v30,28.5 | LED37.C 39,42.31 v39,28.5 | LED45.C 47,42.02 v47,28.5 | LED53.C 55,41.74 v55,28.5 | LED61.C 62.5,40.96 v62.5,28.5 | LED5.C 8,43.96 8,41.5 6,39.5 v6,28.5
  Bottom 0.406: v62.5,28.5 v55,28.5 v47,28.5 v39,28.5 v30,28.5 v22,28.5 v14,28.5 v11,28.5 v6,28.5 | v11,22.5 11,22 11.5,21.5 33,21.5 33.17,21.32 33.17,14.01 U2.3
N$8  (via drill 0.6)
  Top 0.406: v46,17.75 46,68.5 46.5,69 v47,69 47,62.5 49.18,60.32 LED46.C | LED62.C 65.75,59.75 62.5,63 v62.5,68 | LED54.C 57.46,60.04 55,62.5 v55,69 | LED38.C 40.9,60.1 39,62 v39,69 | LED30.C 32.61,59.89 30,62.5 v30,69 | LED22.C 24.33,60.17 22,62.5 v22,69 | LED14.C 16.04,60.46 14,62.5 v14,69 | LED6.C 7.76,60.24 6,62 v6,69
  Bottom 0.406: v6,69 v14,69 v22,69 v30,69 v39,69 v47,69 v55,69 61.5,69 v62.5,68 | v46,17.75 46,17.25 45.75,17 42.5,17 41.98,16.48 41.98,13.92 U2.10
N$9  (via drill 0.6)
  Top 0.406: v7,70 7.76,69.24 LED7.C | LED15.C 16.04,68.96 v15,70 13.5,70 12.25,68.75 12.25,22.75 v12.5,22.5 | v23,70 24.33,68.67 LED23.C | v31,70 32.61,68.39 LED31.C | v40,70 40.9,69.11 LED39.C | v48,70 49.18,68.82 LED47.C | v56,70 57.46,68.54 LED55.C | v65,70 65.75,69.25 LED63.C
  Bottom 0.406: v65,70 v56,70 v48,70 v40,70 v31,70 v23,70 v15,70 v7,70 | v12.5,22.5 35,22.5 35.5,22 35.5,13.25 35.48,14.03 U2.5
N$10  (via drill 0.6)
  Top 0.406: LED8.C 6.54,71.54 v6,71 | LED16.C 14.54,71.54 v14,71 | LED24.C 22.54,71.54 v22,71 | LED32.C 30.54,71.54 v30,71 | LED40.C 39.54,71.54 v39,71 | LED48.C 47.54,71.54 v47,71 | LED56.C 55.54,71.54 v55,71 | LED64.C 63.54,71.54 v63,71 | v45,18.75 v45,71
  Bottom 0.406: v6,71 v14,71 v22,71 v30,71 v39,71 v45,71 v47,71 v55,71 v63,71 | v45,18.75 45,18 44.75,17.75 40,17.75 39.35,17.11 U2.8
N$11  (via drill 0.6)
  Top 0.406: LED8.A LED7.A LED6.A LED5.A 9.75,45.18 9.75,37.25 9.24,36.74 LED4.A LED3.A LED2.A 9.24,16.49 8.5,15.75 8.5,9.73 LED1.A 11.76,9.24 13,8 13,3 14.5,1.5 42.75,1.5 43.25,2 v43.25,2.5
  Bottom 0.406: U2.14 43.16,2.58 v43.25,2.5
N$12  (via drill 0.6)
  Top 0.406: LED32.A LED31.A LED30.A LED29.A LED28.A LED27.A LED26.A LED25.A 34.09,6.84 33.5,6.25 32,6.25 v31.75,6.5
  Bottom 0.406: U2.23 31.73,6.24 v31.75,6.5
N$13  (via drill 0.6)
  Top 0.406: LED40.A LED39.A LED38.A LED37.A LED36.A LED35.A LED34.A LED33.A 40.49,9.24 v40,8.75
  Bottom 0.406: v40,8.75 35,8.75 34.27,8.03 U2.21
N$14  (via drill 0.6)
  Top 0.406: LED48.A LED47.A LED46.A LED45.A LED44.A LED43.A LED42.A LED41.A 51,8.91 51,3.25 50.25,2.5 45,2.5 44,3.5 42.5,3.5 42,3 v42,2.5
  Bottom 0.406: v42,2.5 42,3.68 U2.15
N$15  (via drill 0.6)
  Top 0.406: LED56.A LED55.A LED54.A LED53.A LED52.A LED51.A LED50.A LED49.A 59.12,9.19 v59.12,7.5
  Bottom 0.406: v59.12,7.5 40,7.5 39.42,6.92 39.42,3.85 U2.17
N$16  (via drill 0.6)
  Top 0.406: LED64.A LED63.A LED62.A LED61.A LED60.A LED59.A 67.5,27.2 67.5,25.5 69.25,23.75 69.25,20 67.85,18.35 LED58.A 67.23,18.27 71,14.5 71,9 | LED57.A 66.72,9.25 70.75,9.25 71,9 | 71,9 v71,8
  Bottom 0.406: v71,8 60,8 59.5,8.5 42,8.5 40.75,9.75 34,9.75 33.17,8.93 33.17,3.95 U2.22
N$17  (via drill 0.6)
  Top 0.406: LED98.C 40.24,89.76 40.75,90 40.75,91.5 | LED66.C 72.13,16.87 v72.5,17 | LED106.C 72.24,89.76 v72,90 72,91.5 70,93.5 42.75,93.5 40.75,91.5 | LED74.C 80.13,16.87 v80,17 | LED82.C 88.13,16.87 v88,17 | 40.75,91.5 38.75,93.5 9,93.5 7.76,92.26 LED90.C | v70,18.5 v70,77
  Bottom 0.406: v88,17 v80,17 v72.5,17 72,17 72,17.5 71,18.5 v70,18.5 70,17.25 67.73,14.98 U3.11 | v70,77 70,88 v72,90
N$18  (via drill 0.6)
  Top 0.406: 7.65,80.65 LED89.C 7,81.41 7,82 8.5,83.5 37,83.5 39,81.5 | LED97.C 39.65,80.65 v39,80 39,81.5 | LED65.C 72.24,7.76 72,8 v72,15.75 | LED105.C 72.65,80.65 v72,80 72,81.5 70,83.5 41,83.5 39,81.5 | v72,77 71.5,76.5 71.5,16.25 v72,15.75 | LED73.C 80.74,7.76 80,8.5 v80,15.75 | LED81.C 88.74,7.76 88,8.5 v88,15.5 | v72,15.75 72,7 71.5,6.5 63.5,6.5 62.5,7.5 v62.5,17.5
  Bottom 0.406: v88,15.5 v80,15.75 v72,15.75 | v72,77 v72,80 | v62.5,17.5 57,17.5 56.5,17 56.5,14.03 U3.2
N$19  (via drill 0.6)
  Top 0.406: LED91.C 14.65,80.65 v14,80 14,78 15,77 v47,77 63.5,77 64.5,78 68,78 | LED99.C 47.65,80.65 v47,80 | LED67.C 72.52,25.98 v72.5,26 | LED75.C 80.02,25.98 v80,26 | LED107.C 80.65,80.65 v80,80 | LED83.C 88.02,25.98 v88,26 | v80,78 68,78 | v69,26 69,77 68,78 | v78,12.5 v78,26
  Bottom 0.406: v80,80 v80,78 | v47,80 v47,77 | v88,26 v80,26 v78,26 v72.5,26 v69,26 | v78,12.5 75.5,10 62,10 61.2,10.8 61.2,13.65 U3.6
N$20  (via drill 0.6)
  Top 0.406: LED100.C 47.24,89.76 v47,90 | LED68.C 72.59,35.09 v72.5,35 | LED76.C 80.09,35.09 v80,35 79,36 v79,76 | LED108.C 80.24,89.76 v80,90 | LED84.C 88.09,35.09 v88,35 | v80,86.5 v47,86.5 17,86.5 16,87.5 16,89.72 LED92.C | v77,13.5 v77,35
  Bottom 0.406: v72.5,35 v77,35 v80,35 v88,35 | v80,90 v80,86.5 79,85.5 v79,76 | v47,86.5 v47,90 | v77,13.5 75,11.5 74.75,11.25 63.5,11.25 62.66,12.1 U3.7
N$21  (via drill 0.6)
  Top 0.406: LED93.C 22.65,80.65 v22,80 23,79 49.5,79 50.5,80 v55,80 | LED101.C 55.65,80.65 v55,80 | LED69.C 72.7,44.2 v72.5,44 | LED85.C 88.2,44.2 v88,44 | v55,80 56,79 v76.5,79 83,79 84.65,80.65 LED109.C | LED77.C 80.2,44.2 v80,44 | v76.5,77 77,76.5 v77,61 77,44.5 v76.5,44
  Bottom 0.406: v88,44 v80,44 v76.5,44 v72.5,44 | v76.5,77 v76.5,79 | v77,61 68.5,61 67,59.5 67,29 65.5,27.5 65.5,18.5 63.5,16.5 58,16.5 57.5,16 57.5,13.91 U3.3
N$22  (via drill 0.6)
  Top 0.406: LED102.C 55.24,89.76 v55,90 | LED70.C 72.31,53.31 v72.5,53 | LED78.C 80.31,53.31 v80,53 | LED86.C 88.31,53.31 v88,53 87,54 v87,78.5 | LED110.C 88.24,89.76 v88,90 | v55,90 56.5,88.5 83.5,88.5 85,90 v88,90 | v55,90 51.5,90 50,88.5 25.5,88.5 24.33,89.67 LED94.C | v88,90 88,84.5 v87,83.5
  Bottom 0.406: v88,53 v80,53 v72.5,53 70.5,53 69,51.5 69,28 67.5,26.5 67.5,25.5 68.5,24.5 68.5,17 66.5,15 66.5,13.87 U3.10 | v87,83.5 v87,78.5
N$23  (via drill 0.6)
  Top 0.406: LED95.C 30.65,80.65 v30,80 | LED103.C 63.65,80.65 v63,80 | LED71.C 72.43,62.43 v72.5,62 | LED79.C 80.43,62.43 v80,62 | LED87.C 88.43,62.43 v88,62 | v30,78 v63,78 | v62,74.5 62,70 63,69 v64,69 | v86,12.5 86,61.5 v85.5,62
  Bottom 0.406: v30,80 v30,78 | v63,78 63,78.5 | 63,78.5 v63,80 | v72.5,62 v80,62 v85.5,62 v88,62 88,69 87,70 67,70 66,69 v64,69 | v62,74.5 62,77.5 63,78.5 | v86,12.5 82.5,9 61,9 60.05,9.96 60.05,13.77 U3.5
N$24  (via drill 0.6)
  Top 0.406: LED96.C 30.24,89.76 v30,90 | v63,90 63.24,89.76 LED104.C 69.26,89.76 v70.5,91 | LED72.C 72.54,71.54 | 72.54,71.54 v72.5,71 | LED80.C 80.54,71.54 v80,71 | LED88.C 88.54,71.54 v88,71 | v30,87.5 v63,87.5 | 72.54,71.54 72.54,75.54 v74,77
  Bottom 0.406: v30,90 v30,87.5 | v63,87.5 v63,90 | v72.5,71 v80,71 v88,71 89,70 89,60.5 88.5,60 69,60 68,59 68,28.5 66.5,27 66.5,18 63.92,15.43 U3.8 | v74,77 74,89.5 72.5,91 v70.5,91
N$25  (via drill 0.6)
  Top 0.406: v75.5,6.5 75.5,9.23 LED65.A LED66.A LED67.A LED68.A LED69.A LED70.A LED71.A LED72.A
  Bottom 0.406: U3.14 67.73,5.74 68.5,6.5 v75.5,6.5
N$26  (via drill 0.6)
  Top 0.406: LED80.A LED79.A LED78.A LED77.A LED76.A LED75.A LED74.A LED73.A 84,9.04 v84,6.5
  Bottom 0.406: v84,6.5 78.5,1 66.5,1 65.14,2.35 65.14,3.73 U3.16
N$27  (via drill 0.6)
  Top 0.406: LED87.A LED88.A | LED87.A LED86.A LED85.A LED84.A LED83.A LED82.A LED81.A 92,9.16 92,5 91.5,4.5 61.5,4.5 60,3 v60,2.5 | LED87.A 92.08,72.92 92,73
  Bottom 0.406: U3.20 60.12,2.87 v60,2.5
N$28  (via drill 0.6)
  Top 0.406: LED95.A LED93.A LED91.A LED89.A 9.24,79.74 8,78.5 7.5,78.5 | LED96.A LED94.A LED92.A LED90.A 9.5,90.99 9.5,86.5 6.25,83.25 6.25,79.75 7.5,78.5 | 7.5,78.5 10,76 60,76 60.5,75.5 60.5,69.5 61.5,68.5 61.5,22.25 60.5,21.25 v60.5,6.5
  Bottom 0.406: U3.23 56.25,3.84 56.25,6 56.75,6.5 v60.5,6.5
N$29  (via drill 0.6)
  Top 0.406: LED99.A LED97.A 53.87,82.13 54,82 | LED99.A v54,82.13 LED101.A | LED101.A LED103.A | LED104.A LED102.A | LED98.A LED100.A v54,91.25 LED102.A | LED102.A 66.75,91.25 67,91.5 | LED101.A LED99.A | v54,74.5 54,9.5 58,5.5 v58.75,5.5
  Bottom 0.406: v54,74.5 v54,82.13 v54,91.25 | v58.75,5.5 58.75,3.94 U3.21
N$30  (via drill 0.6)
  Top 0.406: LED106.A LED108.A LED110.A LED109.A LED107.A 77,82.13 | 77,82.13 LED105.A | v79,6.5 79,34.5 78,35.5 v78,77 | v78,81.13 77,82.13
  Bottom 0.406: v79,6.5 74.5,2 67,2 66.47,2.54 U3.15 | v78,77 v78,81.13
N$32
  Bottom 0.406: S3.1 2.12,54.12 3,55 7,55 8,54 S4.1 8.85,52 R10.2
N$33
  Bottom 0.406: R2.2 44.92,13.35 U2.12
N$34
  Bottom 0.406: T1.B 27.05,66.15 R14.2
N$35
  Bottom 0.406: U2.1 30.38,13.88 29.5,13 29.5,2 30,1.5 45,1.5 45.5,2 45.5,5 46,5.5 54.5,5.5 55.03,4.96 U3.24
N$36
  Bottom 0.406: MDL1.3 32.5,58.35 R6.1
N$38
  Bottom 0.406: T2.B 21.05,65.9 R15.2
N$39
  Bottom 0.406: LED111.A 10.95,48.8 R12.2
N$40
  Bottom 0.406: R8.2 38.15,39.45 MDL1.11
N$41
  Bottom 0.406: U3.18 62.66,2.85 63.5,2 63.5,1.65 R3.2
N$42
  Bottom 0.406: R9.2 41.15,37.85 40.5,38.5 MDL1.10
N$43  (via drill 0.6)
  Top 0.406: v27.5,3.5 37.25,3.5 v38.25,2.5
  Bottom 0.406: R1.2 28,4.5 28,4 v27.5,3.5 | v38.25,2.5 38.25,3.62 U2.18
N$45
  Bottom 0.406: S1.1 2.12,44.12 3,45 7,45 8,44 S2.1 11,42.85 R11.2
RST
  Bottom 0.406: MDL1.1 27.85,56 C8.1 R5.1 24.15,61.15 25,62 27.9,62 T1.C
RTS  (via drill 0.6)
  Top 0.406: v19,68 v19,75 19.25,75.25 27.75,75.25 28.5,74.5 28.5,62.5 v29.5,61.5
  Bottom 0.406: JP3.2 5.65,78.35 9,75 v19,75 | R15.1 22.85,67.15 22,68 v19,68 | T1.E 28.95,62.05 v29.5,61.5
RXD  (via drill 0.6)
  Top 0.406: v19,65 v19,42.5
  Bottom 0.406: JP3.6 4.81,68.19 6.5,66.5 17.5,66.5 v19,65 | MDL1.15 30.5,42 30,42.5 v19,42.5
SCL  (via drill 0.6)
  Top 0.406: v32.5,41.5 32.5,36.75 v31,35.25
  Bottom 0.406: MDL1.14 v32.5,41.5 | v31,35.25 12.5,35.25 10.96,36.79 U$3.SCL
SDA
  Bottom 0.406: U$3.SDA 13.5,39.75 14.25,40.5 25.5,40.5 28,38 33.5,38 34.5,39 MDL1.13
TXD  (via drill 0.6)
  Top 0.406: v20.5,62 v20.5,41.5
  Bottom 0.406: JP3.7 16.85,65.65 v20.5,62 | v20.5,41.5 26.8,41.5 MDL1.16

### Text on the board
bPlace: DTR | RTS | RST | +3V3 | +5V | TXD | RXD | GND | + | ENTER
tNames: - | +
bNames: Wordclock Small | by www.nupo-artworks.de | - | +